# Altium schematic sheet Heated Bed Controller.SchDoc
size A; SheetNumber: 2; SheetTotal: 7
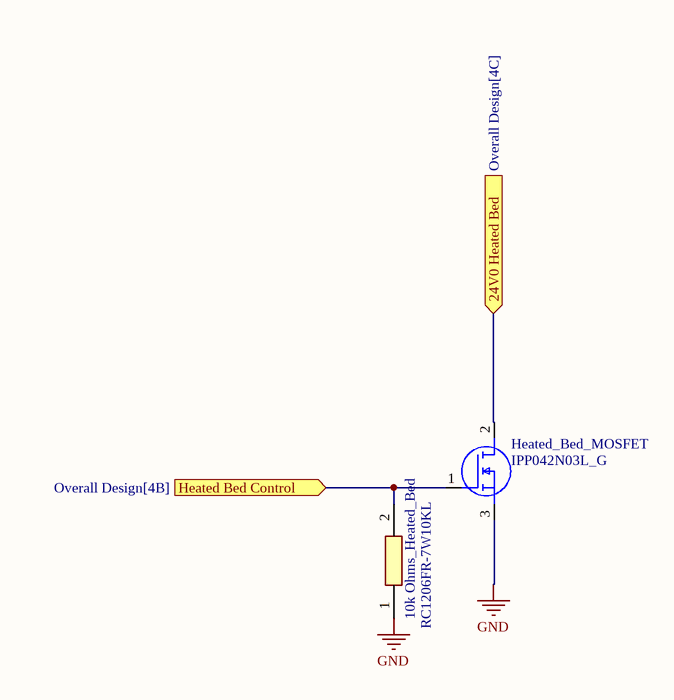
[diagram p0: Heated Bed Controller.SchDoc]

## Parts
10k_Ohms_Heated_Bed  RC1206FR-7W10KL  [RESC3116X65N]
Heated_Bed_MOSFET  IPP042N03L_G  [TO254P457X1003X2115-3P]

## Ports
24V0 Heated Bed (in, see Overall Design[4C]), Heated Bed Control (in, see Overall Design[4B])

## Nets
GND: 10k_Ohms_Heated_Bed.1 Heated_Bed_MOSFET.3(S)
24V0 Heated Bed: Heated_Bed_MOSFET.2(D) ; port 24V0 Heated Bed
Heated Bed Control: 10k_Ohms_Heated_Bed.2 Heated_Bed_MOSFET.1(G) ; port Heated Bed Control

## Library data of the parts
10k_Ohms_Heated_Bed = RC1206FR-7W10KL: Resistor; Manufacturer_Name: KEMET; Datasheet Link: https://datasheet.datasheetarchive.com/originals/distributors/Datasheets_SAMA/902f9e387b938f871d31120f5fc1d65e.pdf; Height: 0.65mm; Manufacturer_Part_Number: RC1206FR-7W10KL; Arrow Part Number: RC1206FR-7W10KL; Arrow Price/Stock: https://www.arrow.com/en/products/rc1206fr-7w10kl/yageo
Heated_Bed_MOSFET = IPP042N03L_G: MOSFET (N-Channel); Manufacturer_Name: Infineon; Manufacturer_Part_Number: IPP042N03L G; Datasheet Link: https://www.infineon.com/dgdl/Infineon-IPP042N03L-DS-v02_00-en.pdf?fileId=db3a30432313ff5e01239ec50f64709d; Height: 4.57mm; Mouser Part Number: 726-IPP042N03LG; Mouser Price/Stock: https://www.mouser.co.uk/ProductDetail/Infineon-Technologies/IPP042N03L-G?qs=mzcOS1kGbgcoiRIwFnG3QQ%3D%3D